# EAGLE schematic endsem (EAGLE 9.6.2)
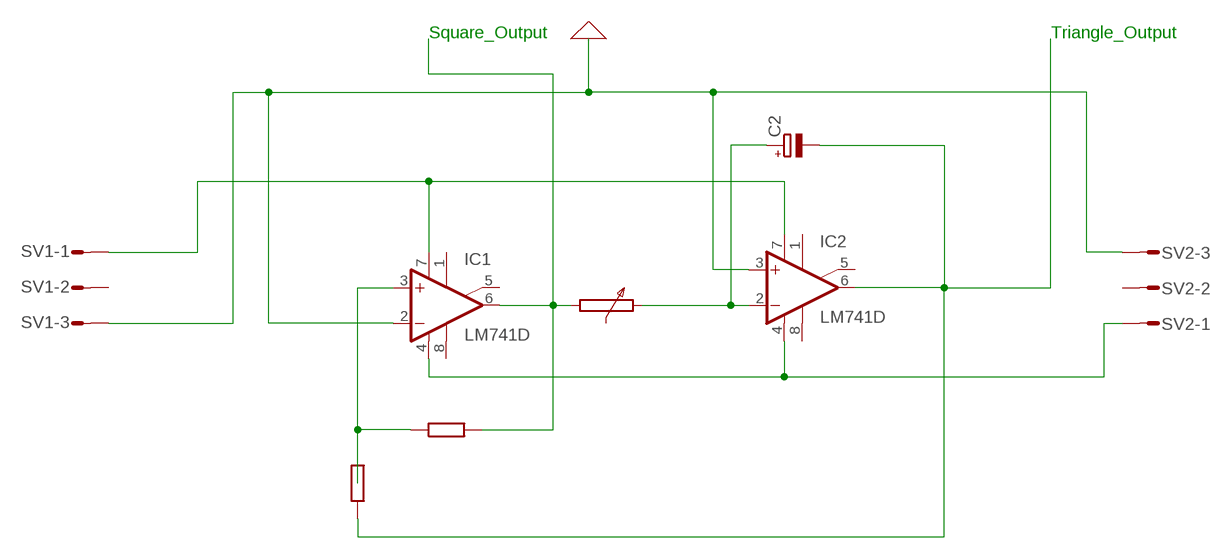
[diagram p0: schematic, sheet 1]

## Parts
C2  CPOL-EUE5-6  [E5-6]
IC1  LM741D  [SO08]
IC2  LM741D  [SO08]
SV1  L03P  [L03P]
SV2  L03P  [L03P]

## Nets
0: IC1.2(-IN) IC2.3(+IN) SV1.3 SV2.3 ; supply symbol labelled GND
N$1: IC1.6(OUT)
N$2: C2.+ IC2.2(-IN)
N$3: IC1.7(V+) IC2.7(V+) SV1.1
N$4: IC1.3(+IN)
N$5: IC1.4(V-) IC2.4(V-) SV2.1
N$6: C2.- IC2.6(OUT)
Unconnected: IC1.1(ON1) IC1.5(ON2) IC1.8(OPT) IC2.1(ON1) IC2.5(ON2) IC2.8(OPT) SV1.2 SV2.2

## Notes on the sheet
- Square_Output | Triangle_Output

## Library data of the parts
C2 = rcl:CPOL-EU: POLARIZED CAPACITOR, European symbol; SPICEPREFIX: C
IC1 IC2 = linear:*741: OP AMP
SV1 SV2 = con-amp-mt:L03P: AMP MT CONNECTOR; OC_FARNELL: unknown; OC_NEWARK: unknown